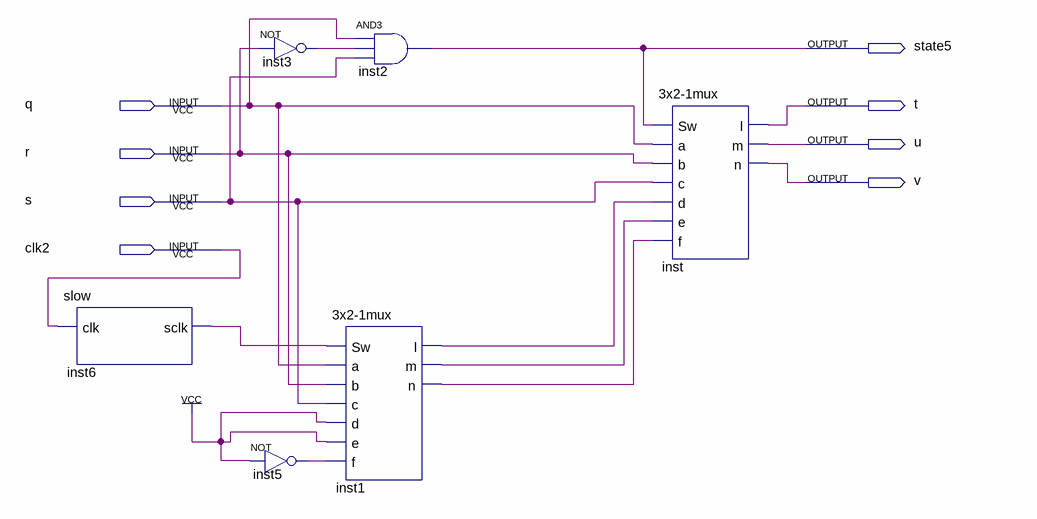
[diagram p0: schematic sheet]
// Quartus schematic flasher.bdf as structural Verilog: 6 symbols, 8 pins
module flasher (
  input  q,
  input  r,
  input  s,
  input  clk2,
  output state5,
  output t,
  output u,
  output v
);

  wire inst1_l, inst1_m, inst1_n, inst3_out, inst5_out, inst6_sclk;

  slow inst6 (.clk(clk2), .sclk(inst6_sclk));
  not inst3 (inst3_out, r);
  not inst5 (inst5_out, 1'b1);
  and inst2 (state5, q, inst3_out, s);
  \3x2-1mux  inst1 (
    .Sw(inst6_sclk), .a(q), .b(r), .c(s), .d(1'b1), .e(1'b1), .f(inst5_out), .l(inst1_l), .m(inst1_m),
    .n(inst1_n));
  \3x2-1mux  inst (.Sw(state5), .a(q), .b(r), .c(s), .d(inst1_l), .e(inst1_m), .f(inst1_n), .l(t), .m(u), .n(v));
endmodule
